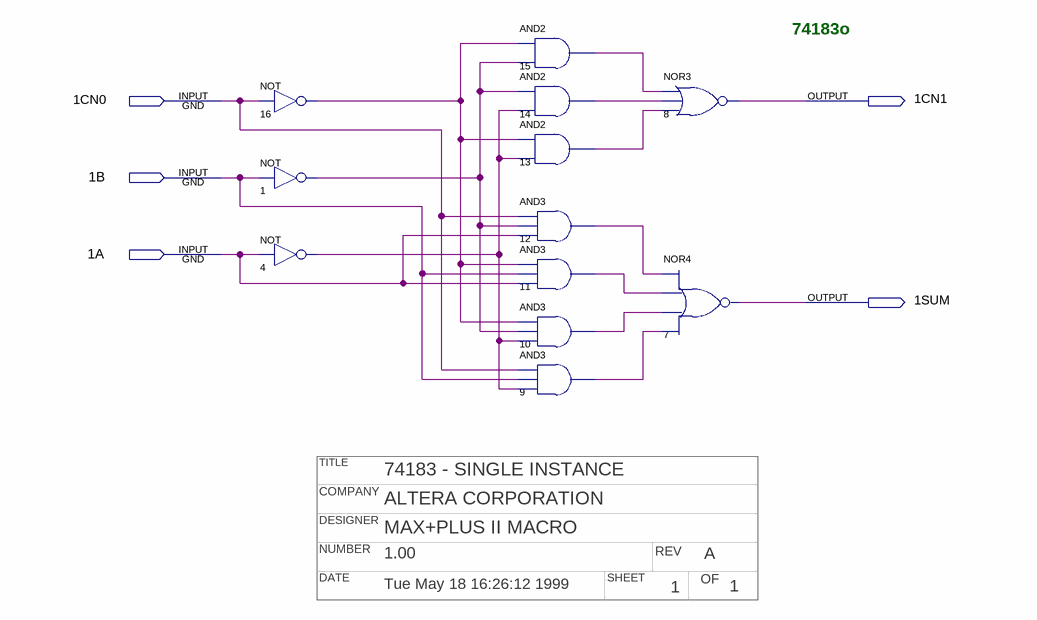
[diagram p0: schematic sheet]
// Quartus schematic 74183o.bdf as structural Verilog: 12 symbols, 5 pins
// Title block: TITLE: 74183 - SINGLE INSTANCE; COMPANY: ALTERA CORPORATION; DESIGNER: MAX+PLUS II MACRO; NUMBER: 1.00; REV: A; DATE: Tue May 18 16:26:12 1999; SHEET: 1; OF: 1
module \74183o  (
  input  \1CN0 ,
  input  \1B ,
  input  \1A ,
  output \1CN1 ,
  output \1SUM 
);

  wire n1_out, n4_out, n9_out, n10_out, n11_out, n12_out, n13_out, n14_out, n15_out, n16_out;

  not u_16 (n16_out, \1CN0 );
  not u_1 (n1_out, \1B );
  not u_4 (n4_out, \1A );
  and u_15 (n15_out, n16_out, n1_out);
  and u_14 (n14_out, n1_out, n4_out);
  and u_13 (n13_out, n16_out, n4_out);
  and u_12 (n12_out, \1CN0 , n1_out, \1A );
  and u_11 (n11_out, n16_out, \1B , \1A );
  and u_10 (n10_out, n16_out, n1_out, n4_out);
  and u_9 (n9_out, \1CN0 , \1B , n4_out);
  nor u_8 (\1CN1 , n15_out, n14_out, n13_out);
  nor u_7 (\1SUM , n12_out, n11_out, n10_out, n9_out);

  // Notes on the sheet:
  //   74183o
endmodule
